# EAGLE design Lid Simulator (EAGLE 9.3.2)
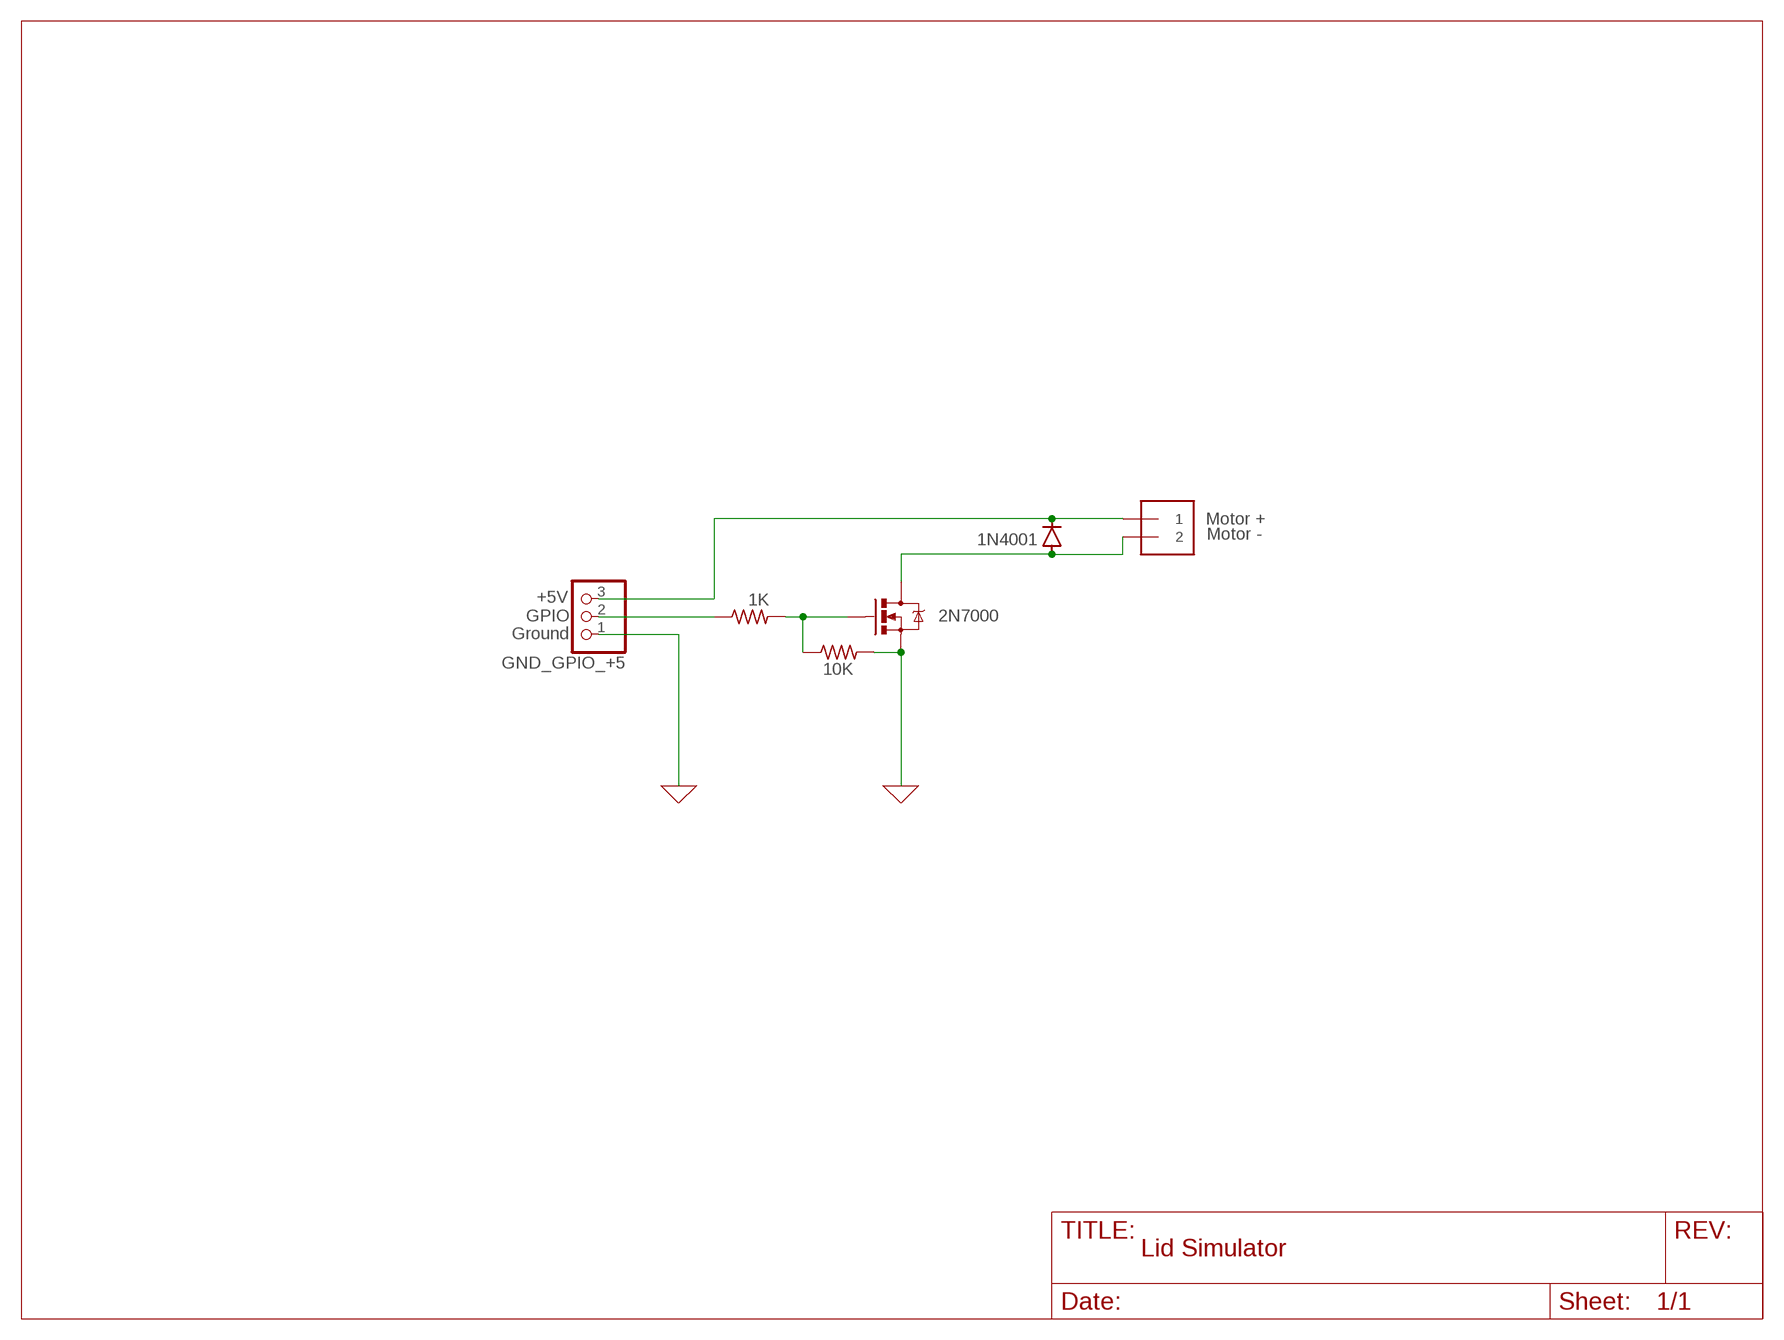
[diagram p0: schematic, sheet 1]

## Parts
D1  1N4001  1N4004  [DO-41]
GND_GPIO_+5  PINHD-1X3CB  [1X03-CLEANBIG]
MOTOR_-__+  1X2-3.5MM  [1X2-3.5MM]
Q1  MOSFET-NCHANNEL2N7000  [TO-92]
R1  1K  R-US_0207/10  [0207/10]
R2  10K  R-US_0207/10  [0207/10]

## Nets
0: GND_GPIO_+5.1 Q1.1(S) R2.2 ; supply symbol labelled GND
N$1: D1.A MOTOR_-__+.2 Q1.3(D)
N$2: Q1.2(G) R1.2 R2.1
N$3: GND_GPIO_+5.2 R1.1
N$5: D1.C GND_GPIO_+5.3 MOTOR_-__+.1

## Notes on the sheet
- Motor +
- Motor -
- +5V
- GPIO | 2N7000
- Ground

## Library data of the parts
D1 = Diodes:1N4004: DIODE GEN PURP 400V 1A DO41 Manufacturer's datasheet <https://www.mccsemi.com/pdf/Products/1N4001-1N4007(DO-41).pdf>; CREATED_BY: PCBLayout.com; DIGIKEY_PART_NUMBER: 1N4004MSCT-ND; MANUFACTURER: Micro Commercial Co; MPN: 1N4004; PACKAGE: DO-41
GND_GPIO_+5 = adafruit:PINHD-1X3: PIN HEADER
MOTOR_-__+ = adafruit:1X2: 3.5mm Terminal block http://www.ladyada.net/library/pcb/eaglelibrary.html
Q1 = digikey:MOSFET-NCHANNEL: Common NMOSFET Parts MFG P/N Store ID Prod ID FDD8780 TRANS-09984 SI7820DN TRANS-11055 FDS6630A IC-08089 2N7002PW TRANS-11151 FQP30N06L COM-10213 TRANS-10060 BSS123LT1G TRANS-08345 BSS138 TRANS-00830 BS170 2N7000
R1 R2 = adafruit:R-US_: RESISTOR, American symbol

## Board
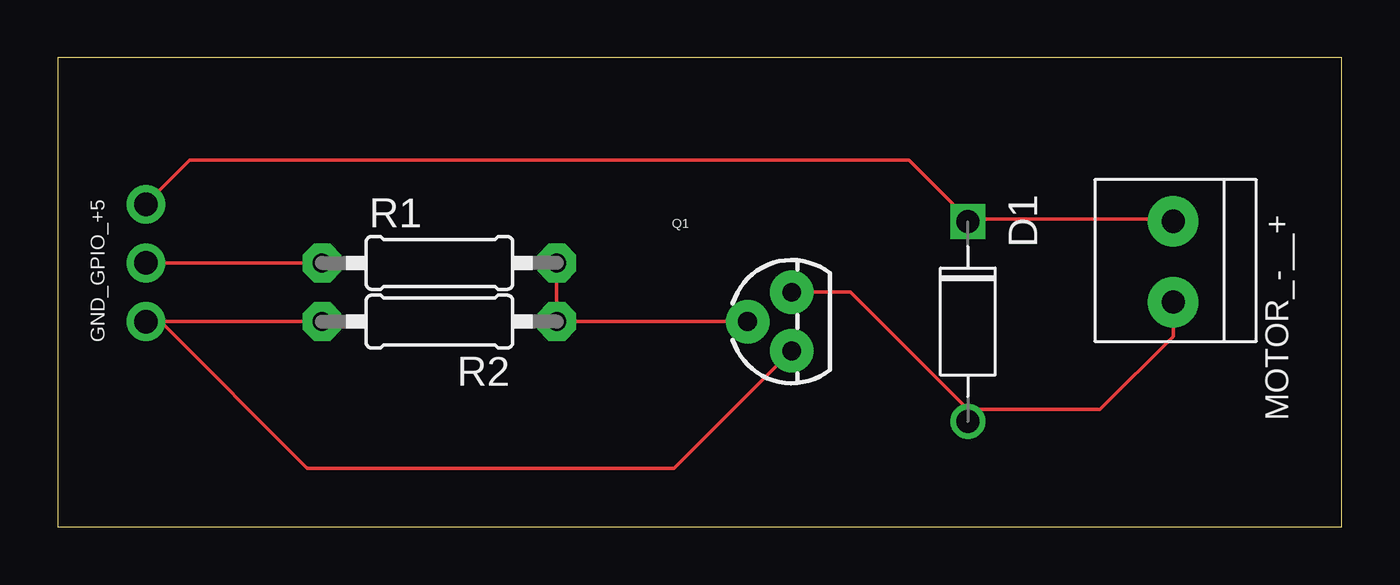
[diagram p1: board, top side]

Size 55.55 x 20.31 mm. Coordinates in mm from the lower left corner, seen from the top.
Outline: 0,0 55.55,0 55.55,20.31 0,20.31 0,0
Copper layers (1*16): Top 0.035mm / dielectric 1.5mm / Bottom 0.035mm
Design rules "default": minimum track width 6mil, minimum drill 0.35mm, track to track 6mil, track to pad 6mil, pad to pad 6mil, via to via 6mil, smd to smd 6mil, copper to edge 40mil, drill to drill 6mil, minimum pad ring 10mil, minimum via ring 8mil, stop-mask expansion 4mil, vias tented up to drill 0mil, thermal gap 10mil

### Footprints (pad centres in the part's own frame; a part is rotated, then mirrored left to right if it is on the bottom)
DO-41 = drill 1: A 4.325,0 | drill 1 square: C -4.325,0
1X03-CLEANBIG = drill 1.016 pad 1.676: 1 -2.54,0; 2 0,0; 3 2.54,0
1X2-3.5MM = drill 1 pad 2.184: 1 1.8,0; 2 -1.7,0
TO-92 = drill 0.813 pad 1.88: 1 -1.27,0; 2 0,1.905; 3 1.27,0
0207/10 = drill 0.813 pad 1.676 octagon: 1 -5.08,0; 2 5.08,0

### Placement (x,y rotation side)
D1  39.37,8.89 270 top
GND_GPIO_+5  3.81,11.43 90 top
MOTOR_-__+  48.26,11.43 90 top
Q1  31.75,8.89 90 top
R1  16.51,11.43 0 top
R2  16.51,8.89 180 top

### Tracks (layer width: path | path; a pad name or v marks a point on that pad's centre or on a via)
0
  Top 0.152: R2.2 4.45,8.89 | 4.45,8.89 GND_GPIO_+5.1 | Q1.1 26.67,2.54 10.79,2.54 4.45,8.89
N$1
  Top 0.152: 39.37,5.08 34.29,10.16 Q1.3 | 39.37,5.08 45.09,5.08 48.26,8.26 MOTOR_-__+.2 | 39.37,5.08 D1.A
N$2
  Top 0.152: R1.2 R2.1 Q1.2
N$3
  Top 0.152: R1.1 GND_GPIO_+5.2
N$5
  Top 0.152: 39.37,13.34 48.26,13.34 MOTOR_-__+.1 | GND_GPIO_+5.3 5.71,15.88 36.83,15.88 39.37,13.34 | 39.37,13.34 D1.C